# EAGLE schematic squematic2 (EAGLE 7.6.0)
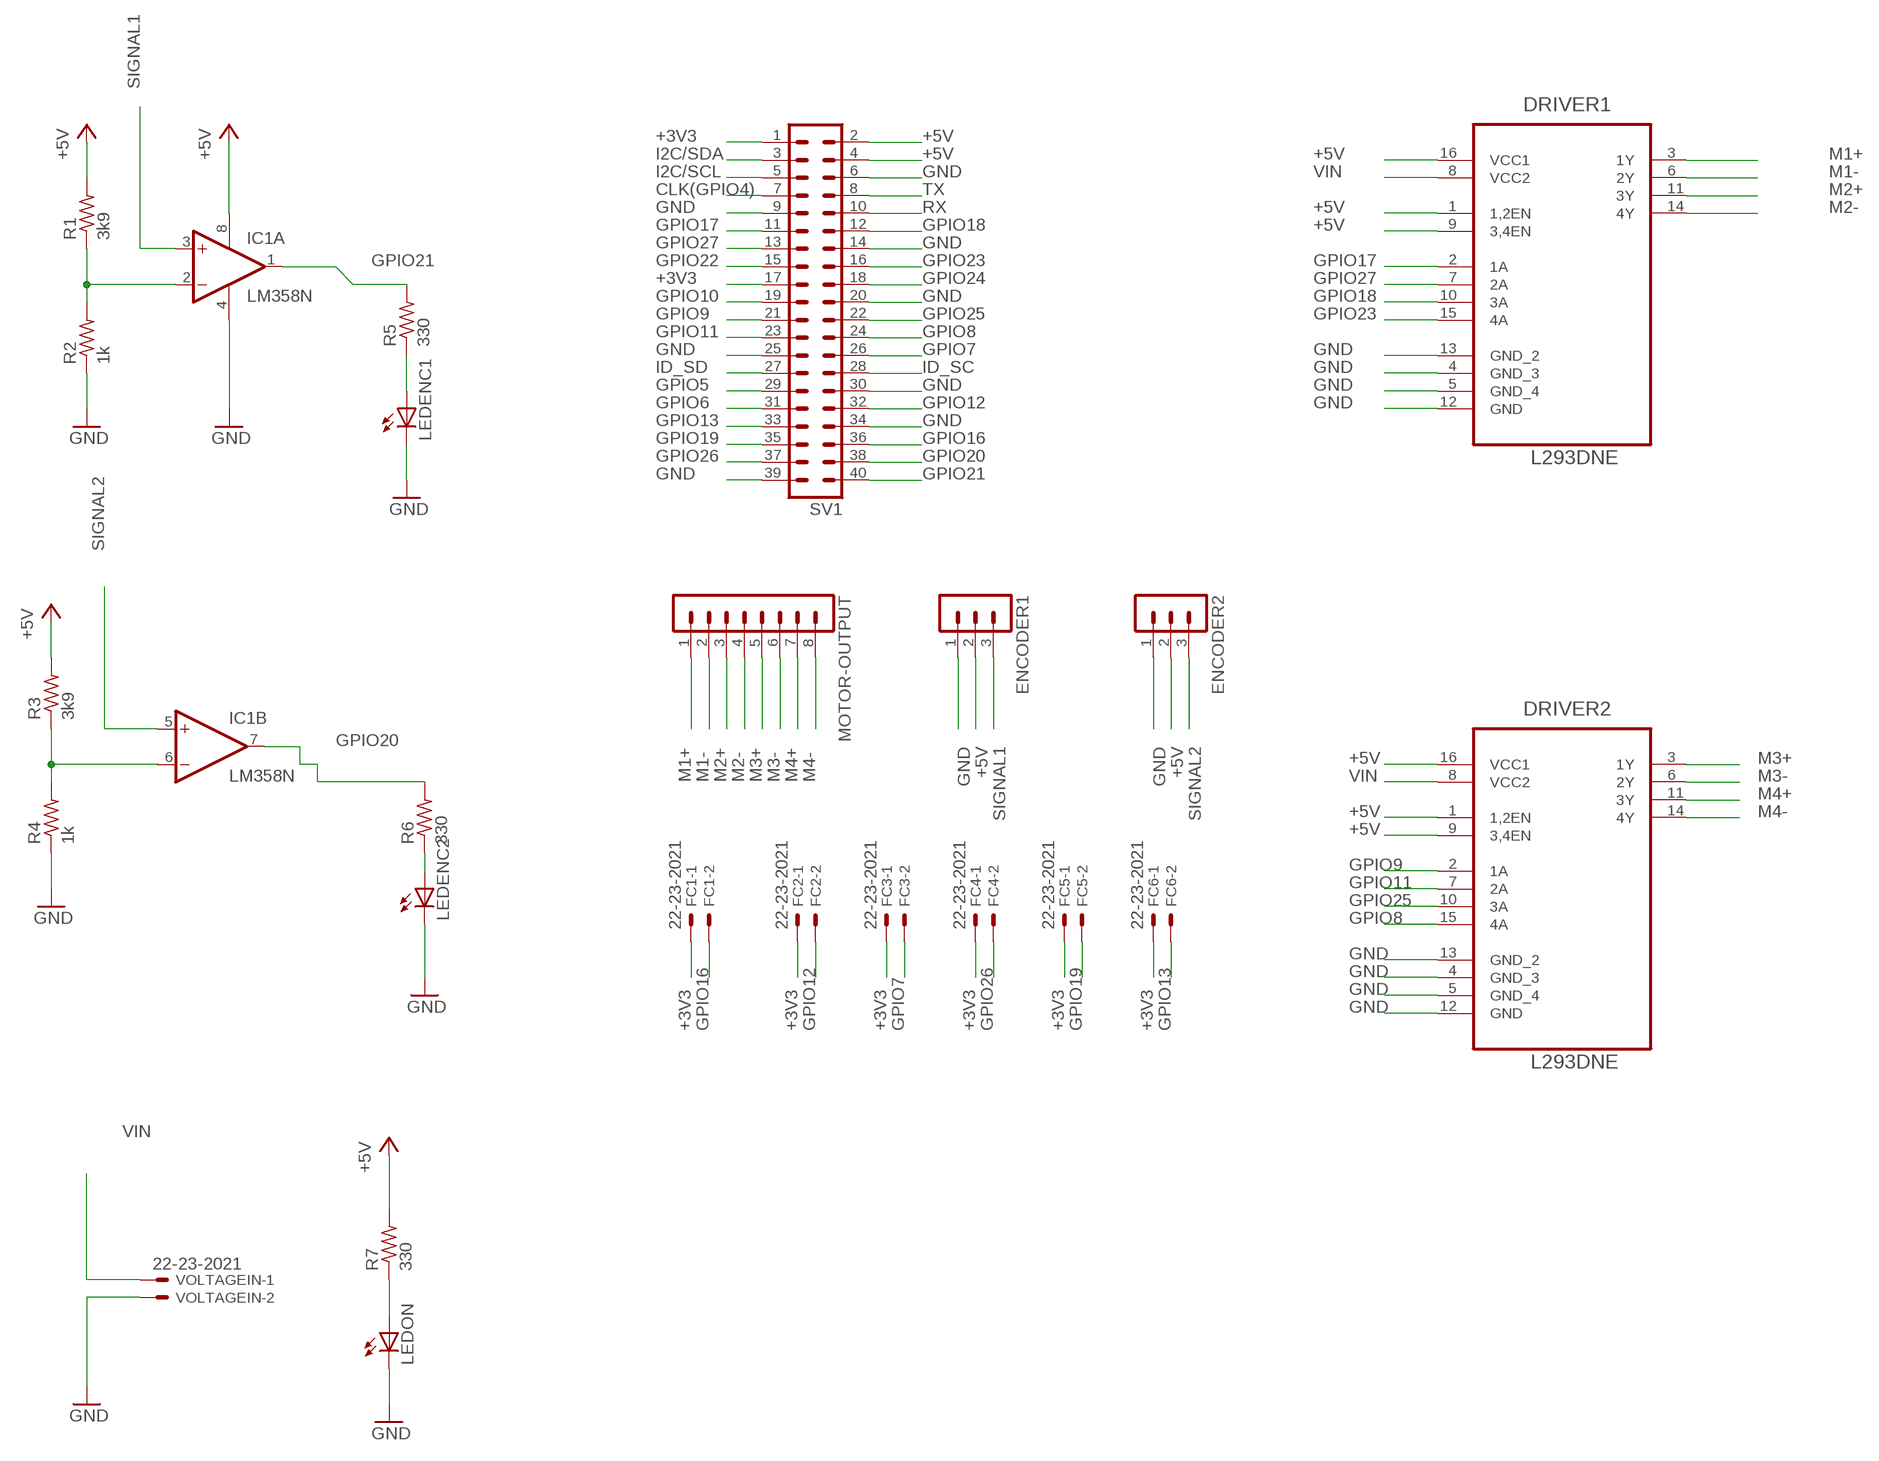
[diagram p0: schematic, sheet 1]

## Parts
DRIVER1  L293DNE  [DIP254P762X508-16]
DRIVER2  L293DNE  [DIP254P762X508-16]
ENCODER1  MA03-1  [MA03-1]
ENCODER2  MA03-1  [MA03-1]
FC1  22-23-2021  [22-23-2021]
FC2  22-23-2021  [22-23-2021]
FC3  22-23-2021  [22-23-2021]
FC4  22-23-2021  [22-23-2021]
FC5  22-23-2021  [22-23-2021]
FC6  22-23-2021  [22-23-2021]
IC1  LM358N  [DIL08]
LEDENC1  LED3MM  [LED3MM]
LEDENC2  LED3MM  [LED3MM]
LEDON  LED3MM  [LED3MM]
MOTOR-OUTPUT  MA08-1  [MA08-1]
R1  3k9  R-US_0207/10  [0207/10]
R2  1k  R-US_0207/10  [0207/10]
R3  3k9  R-US_0207/10  [0207/10]
R4  1k  R-US_0207/10  [0207/10]
R5  330  R-US_0207/10  [0207/10]
R6  330  R-US_0207/10  [0207/10]
R7  330  R-US_0207/10  [0207/10]
SV1  MA20-2  [MA20-2]
VOLTAGEIN  22-23-2021  [22-23-2021]

## Nets
+3V3: FC1.1 FC2.1 FC3.1 FC4.1 FC5.1 FC6.1 SV1.1 SV1.17
+5V: DRIVER1.1(1,2EN) DRIVER1.9(3,4EN) DRIVER1.16(VCC1) DRIVER2.1(1,2EN) DRIVER2.9(3,4EN) DRIVER2.16(VCC1) ENCODER1.2 ENCODER2.2 IC1.8(P:V+) R1.2 R3.2 R7.2 SV1.2 SV1.4
CLK(GPIO4): SV1.7
GND: DRIVER1.4(GND_3) DRIVER1.5(GND_4) DRIVER1.12(GND) DRIVER1.13(GND_2) DRIVER2.4(GND_3) DRIVER2.5(GND_4) DRIVER2.12(GND) DRIVER2.13(GND_2) ENCODER1.1 ENCODER2.1 IC1.4(P:V-) LEDENC1.K(C) LEDENC2.K(C) LEDON.K(C) R2.1 R4.1 SV1.6 SV1.9 SV1.14 SV1.20 SV1.25 SV1.30 SV1.34 SV1.39 VOLTAGEIN.2
GPIO5: SV1.29
GPIO6: SV1.31
GPIO7: FC3.2 SV1.26
GPIO8: DRIVER2.15(4A) SV1.24
GPIO9: DRIVER2.2(1A) SV1.21
GPIO10: SV1.19
GPIO11: DRIVER2.7(2A) SV1.23
GPIO12: FC2.2 SV1.32
GPIO13: FC6.2 SV1.33
GPIO16: FC1.2 SV1.36
GPIO17: DRIVER1.2(1A) SV1.11
GPIO18: DRIVER1.10(3A) SV1.12
GPIO19: FC5.2 SV1.35
GPIO20: IC1.7(B:OUT) R6.2 SV1.38
GPIO21: IC1.1(A:OUT) R5.2 SV1.40
GPIO22: SV1.15
GPIO23: DRIVER1.15(4A) SV1.16
GPIO24: SV1.18
GPIO25: DRIVER2.10(3A) SV1.22
GPIO26: FC4.2 SV1.37
GPIO27: DRIVER1.7(2A) SV1.13
I2C/SCL: SV1.5
I2C/SDA: SV1.3
ID_SC: SV1.28
ID_SD: SV1.27
M1+ [potencia]: DRIVER1.3(1Y) MOTOR-OUTPUT.1
M1- [potencia]: DRIVER1.6(2Y) MOTOR-OUTPUT.2
M2+ [potencia]: DRIVER1.11(3Y) MOTOR-OUTPUT.3
M2- [potencia]: DRIVER1.14(4Y) MOTOR-OUTPUT.4
M3+ [potencia]: DRIVER2.3(1Y) MOTOR-OUTPUT.5
M3- [potencia]: DRIVER2.6(2Y) MOTOR-OUTPUT.6
M4+ [potencia]: DRIVER2.11(3Y) MOTOR-OUTPUT.7
M4- [potencia]: DRIVER2.14(4Y) MOTOR-OUTPUT.8
N$1: IC1.2(A:-IN) R1.1 R2.2
N$2: IC1.6(B:-IN) R3.1 R4.2
N$3: LEDENC1.A R5.1
N$7: LEDENC2.A R6.1
N$8: LEDON.A R7.1
RX: SV1.10
SIGNAL1: ENCODER1.3 IC1.3(A:+IN)
SIGNAL2: ENCODER2.3 IC1.5(B:+IN)
TX: SV1.8
VIN [potencia]: DRIVER1.8(VCC2) DRIVER2.8(VCC2) VOLTAGEIN.1

## Library data of the parts
DRIVER1 DRIVER2 = Texas Instruments_By_element14_Batch_1:L293DNE: QUADRUPLE HALF-H DRIVERS; MPN: L293DNE; OC_FARNELL: 1470423; OC_NEWARK: 06F9523; PACKAGE: PDIP-16; SUPPLIER: Texas Instruments
ENCODER1 ENCODER2 = con-lstb:MA03-1: PIN HEADER; OC_FARNELL: unknown; OC_NEWARK: unknown
FC1-FC6 VOLTAGEIN = con-molex:22-23-2021: .100" (2.54mm) Center Header - 2 Pin; MF: MOLEX; MPN: 22-23-2021; OC_FARNELL: 1462926; OC_NEWARK: 25C3832
IC1 = linear:LM358: OP AMP also LM158; LM258; LM2904 Source: http://cache.national.com/ds/LM/LM158.pdf
LEDENC1 LEDENC2 LEDON = led:LED: LED OSRAM: - CHIPLED LG R971, LG N971, LY N971, LG Q971, LY Q971, LO R971, LY R971 LH N974, LH R974 LS Q976, LO Q976, LY Q976 LO Q996 - Hyper CHIPLED LW Q18S LB Q993, LB Q99A, LB R99A - SideLED LS A670, LO A670, LY A670, LG A670, LP A670 LB A673, LV A673, LT A673, LW A673 LH A674 LY A675 LS A676, LA A676, LO A676, LY A676, LW A676 LS A679, LY A679, LG A679 - Hyper Micro SIDELED® LS Y876, LA Y876, LO Y876, LY Y876 LT Y87S - SmartLED LW L88C, LW L88S LB L89C, LB L89S, LG L890 LS L89K, LO L89K, LY L89K LS L896, LA L896, LO L896, LY L896 - TOPLED LS T670, LO T670, LY T670, LG T670, LP T670 LSG T670, LSP T670, LSY T670, LOP T670, LYG T670 LG T671, LOG T671, LSG T671 LB T673, LV T673, LT T673, LW T673 LH T674 LS T676, LA T676, LO T676, LY T676, LB T676, LH T676, LSB T676, LW T676 LB T67C, LV T67C, LT T67C, LS T67K, LO T67K, LY T67K, LW E67C LS E67B, LA E67B, LO E67B, LY E67B, LB E67C, LV E67C, LT E67C LW T67C LS T679, LY T679, LG T679 LS T770, LO T770, LY T770, LG T770, LP T770 LB T773, LV T773, LT T773, LW T773 LH T774 LS E675, LA E675, LY E675, LS T675 LS T776, LA T776, LO T776, LY T776, LB T776 LHGB T686 LT T68C, LB T68C - Hyper Mini TOPLED® LB M676 - Mini TOPLED Santana® LG M470 LS M47K, LO M47K, LY M47K Source: http://www.osram.convergy.de LUXEON: - LUMILED® LXK2-PW12-R00, LXK2-PW12-S00, LXK2-PW14-U00, LXK2-PW14-V00 LXK2-PM12-R00, LXK2-PM12-S00, LXK2-PM14-U00 LXK2-PE12-Q00, LXK2-PE12-R00, LXK2-PE12-S00, LXK2-PE14-T00, LXK2-PE14-U00 LXK2-PB12-K00, LXK2-PB12-L00, LXK2-PB12-M00, LXK2-PB14-N00, LXK2-PB14-P00, LXK2-PB14-Q00 LXK2-PR12-L00, LXK2-PR12-M00, LXK2-PR14-Q00, LXK2-PR14-R00 LXK2-PD12-Q00, LXK2-PD12-R00, LXK2-PD12-S00 LXK2-PH12-R00, LXK2-PH12-S00 LXK2-PL12-P00, LXK2-PL12-Q00, LXK2-PL12-R00 Source: www.luxeon.com KINGBRIGHT: KA-3528ASYC Source: www.kingbright.com
MOTOR-OUTPUT = con-lstb:MA08-1: PIN HEADER; OC_FARNELL: unknown; OC_NEWARK: unknown
R1-R7 = rcl:R-US_: RESISTOR, American symbol
SV1 = con-lstb:MA20-2: PIN HEADER; OC_FARNELL: unknown; OC_NEWARK: unknown

## Net classes
0 default: width 0.203 mm, clearance 0.254 mm
1 potencia: width 1.016 mm